# Altium schematic sheet USB-C.SchDoc
size B; DocumentFullName: Connectors and Power; Organization: Reclaimer Labs, LLC; Address1: 3652 Beth Ct; Address2: Santa Clara CA 95054; DocumentNumber: 1; SheetNumber: 1; SheetTotal: 3; License: Open Source Hardware - MIT License
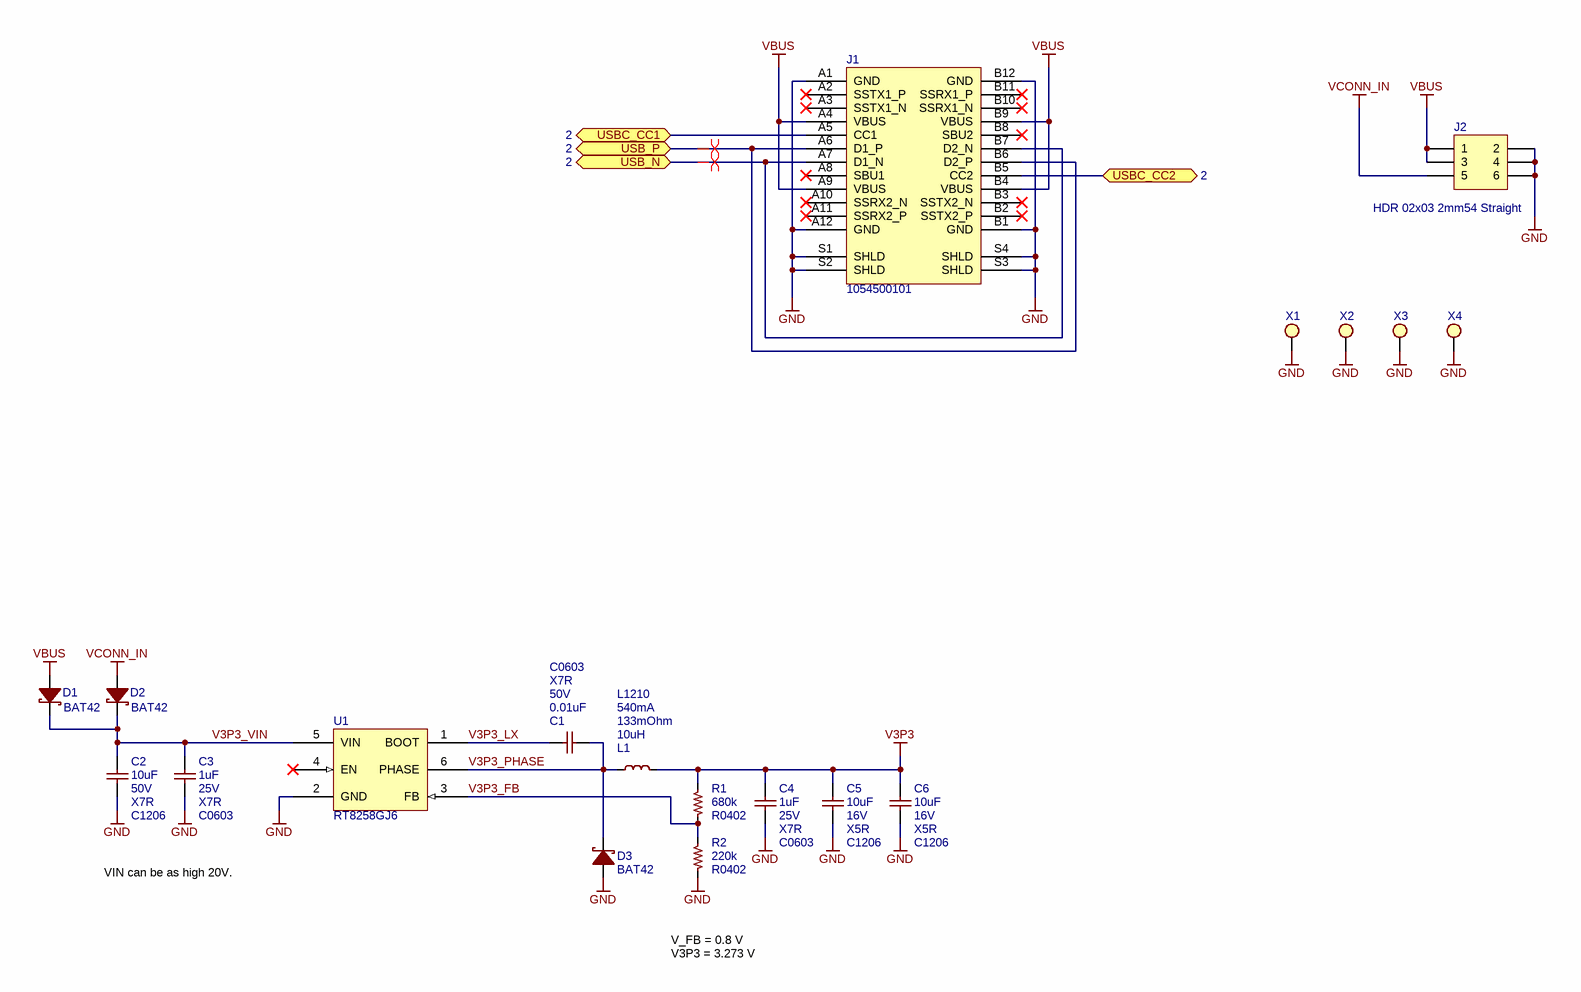
[diagram p0: USB-C.SchDoc]

## Parts
C1  value 0.01uF  Voltage: 50V  Material: X7R  [C0603]  (hidden comment: MF-CAP-0603-0.01uF)
C2  value 10uF  Voltage: 50V  Material: X7R  [C1206]  (hidden comment: CL31B106KBHNNNE)
C3  value 1uF  Voltage: 25V  Material: X7R  [C0603]  (hidden comment: MF-CAP-0603-1uF)
C4  value 1uF  Voltage: 25V  Material: X7R  [C0603]  (hidden comment: MF-CAP-0603-1uF)
C5  value 10uF  Voltage: 16V  Material: X5R  [C1206]  (hidden comment: MF-CAP-1206-10uF)
C6  value 10uF  Voltage: 16V  Material: X5R  [C1206]  (hidden comment: MF-CAP-1206-10uF)
D1  value BAT42  [SOD-123]  (hidden comment: MF-DIO-SOD123-BAT42)
D2  value BAT42  [SOD-123]  (hidden comment: MF-DIO-SOD123-BAT42)
D3  value BAT42  [SOD-123]  (hidden comment: MF-DIO-SOD123-BAT42)
J1  1054500101  [1054500101]
J2  value HDR 02x03 2mm54 Straight  [CONN_HEADER_02x03_2mm54_Straight]  (hidden comment: MF-CON-2.54mm-2x3)
L1  value 10uH  DCR: 133mOhm  Current: 540mA  [L1210]  (hidden comment: MF-IND-1210-10uH)
R1  value 680k  [R0402]  (hidden comment: MF-RES-0402-680K)
R2  value 220k  [R0402]  (hidden comment: MF-RES-0402-220K)
U1  RT8258GJ6  [SOT23-6]
X1  MTHOLE  (value not drawn)  (no BOM)
X2  MTHOLE  (value not drawn)  (no BOM)
X3  MTHOLE  (value not drawn)  (no BOM)
X4  MTHOLE  (value not drawn)  (no BOM)

## Ports
USB_N (bidir, see 2), USB_P (bidir, see 2), USBC_CC1 (bidir, see 2), USBC_CC2 (bidir, see 2)

## Nets
GND: C2.2(C2) C3.2(C2) C4.2(C2) C5.2(C2) C6.2(C2) D3.2(C2) J1.A1(GND) J1.A12(GND) J1.B1(GND) J1.B12(GND) J1.S1(SHLD) J1.S2(SHLD) J1.S3(SHLD) J1.S4(SHLD) J2.2 J2.4 J2.6 R2.2(R2) U1.2(GND) X1.1 X2.1 X3.1 X4.1
V3P3: C4.1(C1) C5.1(C1) C6.1(C1) L1.2(R2) R1.1(R1)
VBUS: D1.2(C2) J1.A4(VBUS) J1.A9(VBUS) J1.B4(VBUS) J1.B9(VBUS) J2.1 J2.3
VCONN_IN: D2.2(C2) J2.5
USB_N: J1.A7(D1_N) J1.B7(D2_N) ; port USB_N
USB_P: J1.A6(D1_P) J1.B6(D2_P) ; port USB_P
USBC_CC1: J1.A5(CC1) ; port USBC_CC1
USBC_CC2: J1.B5(CC2) ; port USBC_CC2
V3P3_FB: R1.2(R2) R2.1(R1) U1.3(FB)
V3P3_LX: C1.1(C1) U1.1(BOOT)
V3P3_PHASE: C1.2(C2) D3.1(C1) L1.1(R1) U1.6(PHASE)
V3P3_VIN: C2.1(C1) C3.1(C1) D1.1(C1) D2.1(C1) U1.5(VIN)

Not connected (* = marked no-connect by the designer): J1 A2(SSTX1_P)* A3(SSTX1_N)* A8(SBU1)* A10(SSRX2_N)* A11(SSRX2_P)* B2(SSTX2_P)* B3(SSTX2_N)* B8(SBU2)* B10(SSRX1_N)* B11(SSRX1_P)*; U1 4(EN)*

## Layout directives
differential pair: USB_N, USB_P

## Notes on the sheet
- VIN can be as high 20V.
- V_FB = 0.8 V
  V3P3 = 3.273 V
- Project:
- Date:
- Revision:
- Drawn By:
- Document:
- Time:
- Sheet
- of

## Library data of the parts
C1 C3-C6 = CAPACITOR_NP: Manufacturer 1: MacroFab
  C1: Manufacturer Part Number 1: MF-CAP-0603-0.01uF; DisplayFootprint: C0603
  C3 C4: Manufacturer Part Number 1: MF-CAP-0603-1uF; DisplayFootprint: C0603
  C5 C6: Manufacturer Part Number 1: MF-CAP-1206-10uF; DisplayFootprint: C1206
C2 = CAPACITOR_NP: Manufacturer 1: Samsung; Supplier 1: Digi-Key; Supplier Part Number 1: 1276-6767-1-ND; DisplayFootprint: C1206; Manufacturer Part Number 1: CL31B106KBHNNNE
D1 D2 = DIODE_SCHOTTKY: Manufacturer: MacroFab; Manufacturer Part Number 1: MF-DIO-SOD123-BAT42
D3 = DIODE_SCHOTTKY: Manufacturer 1: MacroFab; Manufacturer Part Number 1: MF-DIO-SOD123-BAT42
J1 = USB-C_RECPT: Manufacturer: Molex; Value: 1054500101; Manufacturer Part Number 1: 1054500101
J2 = CONN_HEADER_02x03_2mm54_Straight: Manufacturer 1: MacroFab; Manufacturer Part Number 1: MF-CON-2.54mm-2x3
L1 = INDUCTOR: Manufacturer 1: MacroFab; FootprintDisplay: L1210; Manufacturer Part Number 1: MF-IND-1210-10uH
R1 R2 = RESISTOR: Manufacturer 1: MacroFab; FootprintDisplay: R0402
  R1: Manufacturer Part Number 1: MF-RES-0402-680K
  R2: Manufacturer Part Number 1: MF-RES-0402-220K
U1 = BUCK_RT8258GJ6: Manufacturer 1: Richtek; Value: RT8258GJ6; Supplier 1: Digi-Key; Supplier Part Number 1: 1028-1044-1-ND; Manufacturer Part Number 1: RT8258GJ6